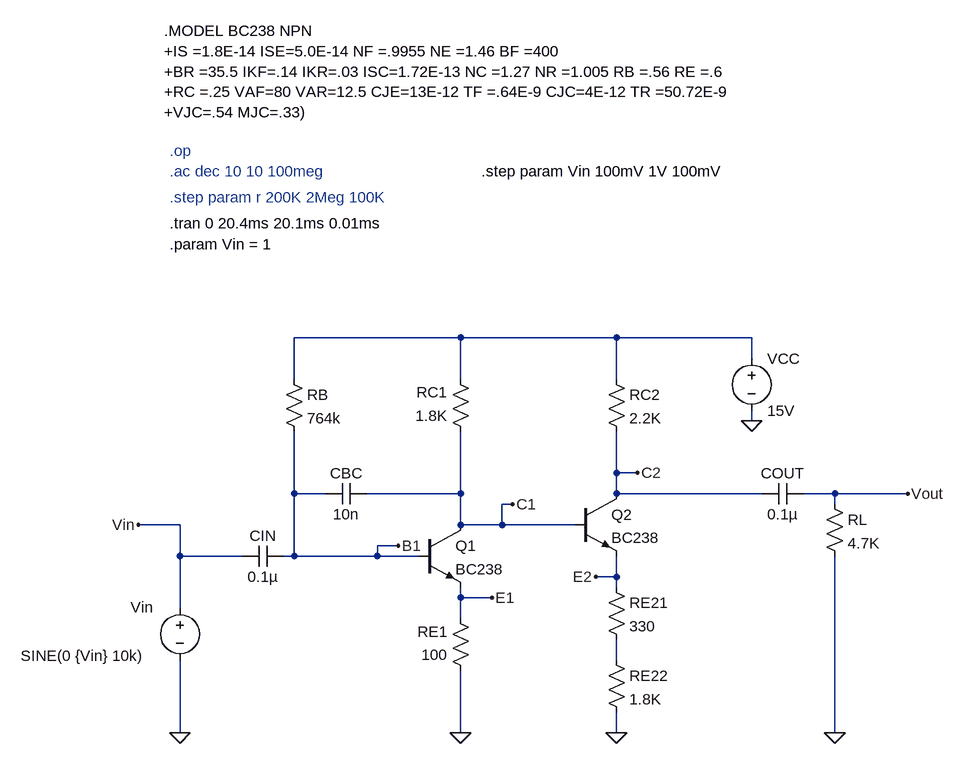
[diagram p0: schematic exercise3_1v2.asc]
exercise3_1v2.asc, the LTspice schematic file:
Version 4.1
SHEET 1 1064 680
WIRE 304 -272 48 -272
WIRE 544 -272 304 -272
WIRE 752 -272 544 -272
WIRE 752 -240 752 -272
WIRE 48 -208 48 -272
WIRE 304 -208 304 -272
WIRE 544 -208 544 -272
WIRE 752 -144 752 -160
WIRE 544 -64 544 -128
WIRE 576 -64 544 -64
WIRE 48 -32 48 -128
WIRE 96 -32 48 -32
WIRE 304 -32 304 -128
WIRE 304 -32 160 -32
WIRE 544 -32 544 -64
WIRE 768 -32 544 -32
WIRE 880 -32 832 -32
WIRE 992 -32 880 -32
WIRE 384 -16 368 -16
WIRE 880 -16 880 -32
WIRE -128 16 -192 16
WIRE 304 16 304 -32
WIRE 368 16 368 -16
WIRE 368 16 304 16
WIRE 480 16 368 16
WIRE 208 48 176 48
WIRE -128 64 -128 16
WIRE -32 64 -128 64
WIRE 48 64 48 -32
WIRE 48 64 32 64
WIRE 176 64 176 48
WIRE 176 64 48 64
WIRE 240 64 176 64
WIRE 544 96 544 64
WIRE 544 96 512 96
WIRE 544 112 544 96
WIRE 304 128 304 112
WIRE 352 128 304 128
WIRE -128 144 -128 64
WIRE 304 160 304 128
WIRE 544 224 544 192
WIRE -128 336 -128 224
WIRE 304 336 304 240
WIRE 544 336 544 304
WIRE 880 336 880 64
FLAG 992 -32 Vout
FLAG 752 -144 0
FLAG -192 16 Vin
FLAG 544 336 0
FLAG 304 336 0
FLAG 208 48 B1
FLAG 384 -16 C1
FLAG 576 -64 C2
FLAG 512 96 E2
FLAG 352 128 E1
FLAG 880 336 0
FLAG -128 336 0
SYMBOL res 320 -112 R180
WINDOW 0 36 76 Left 2
WINDOW 3 36 40 Left 2
SYMATTR InstName RC1
SYMATTR Value 1.8K
SYMBOL res 320 256 R180
WINDOW 0 36 76 Left 2
WINDOW 3 36 40 Left 2
SYMATTR InstName RE1
SYMATTR Value 100
SYMBOL res 528 -224 R0
SYMATTR InstName RC2
SYMATTR Value 2.2K
SYMBOL res 528 96 R0
SYMATTR InstName RE21
SYMATTR Value 330
SYMBOL res 864 -32 R0
SYMATTR InstName RL
SYMATTR Value 4.7K
SYMBOL voltage -128 128 R0
WINDOW 0 -76 15 Left 2
WINDOW 3 -245 89 Left 2
WINDOW 123 0 0 Left 0
WINDOW 39 0 0 Left 0
SYMATTR InstName Vin
SYMATTR Value SINE(0 {Vin} 10k)
SYMBOL cap 32 48 R90
WINDOW 0 0 32 VBottom 2
WINDOW 3 32 32 VTop 2
SYMATTR InstName CIN
SYMATTR Value 0.1µ
SYMBOL cap 832 -48 R90
WINDOW 0 0 32 VBottom 2
WINDOW 3 32 32 VTop 2
SYMATTR InstName COUT
SYMATTR Value 0.1µ
SYMBOL npn 240 16 R0
SYMATTR InstName Q1
SYMATTR Value BC238
SYMBOL npn 480 -32 R0
SYMATTR InstName Q2
SYMATTR Value BC238
SYMBOL voltage 752 -256 R0
SYMATTR InstName VCC
SYMATTR Value 15V
SYMBOL res 528 208 R0
SYMATTR InstName RE22
SYMATTR Value 1.8K
SYMBOL cap 160 -48 R90
WINDOW 0 0 32 VBottom 2
WINDOW 3 32 32 VTop 2
SYMATTR InstName CBC
SYMATTR Value 10n
SYMBOL res 32 -224 R0
SYMATTR InstName RB
SYMATTR Value 764k
TEXT -152 -744 Left 2 !.MODEL BC238 NPN\n+IS =1.8E-14 ISE=5.0E-14 NF =.9955 NE =1.46 BF =400\n+BR =35.5 IKF=.14 IKR=.03 ISC=1.72E-13 NC =1.27 NR =1.005 RB =.56 RE =.6\n+RC =.25 VAF=80 VAR=12.5 CJE=13E-12 TF =.64E-9 CJC=4E-12 TR =50.72E-9\n+VJC=.54 MJC=.33)
TEXT -144 -560 Left 2 ;.op
TEXT -144 -528 Left 2 ;.ac dec 10 10 100meg
TEXT -144 -488 Left 2 ;.step param r 200K 2Meg 100K
TEXT -144 -448 Left 2 !.tran 0 20.4ms 20.1ms 0.01ms
TEXT -144 -416 Left 2 !.param Vin = 1
TEXT 336 -528 Left 2 !.step param Vin 100mV 1V 100mV

The netlist it stands for:
* exercise3_1v2.asc
RC1 C1 N001 1.8K
RE1 0 E1 100
RC2 N001 C2 2.2K
RE21 E2 N002 330
RL Vout 0 4.7K
Vin Vin 0 SINE(0 {Vin} 10k)
CIN B1 Vin 0.1µ
COUT Vout C2 0.1µ
Q1 C1 B1 E1 0 BC238
Q2 C2 C1 E2 0 BC238
VCC N001 0 15V
RE22 N002 0 1.8K
CBC C1 B1 10n
RB N001 B1 764k
.model NPN NPN
.model PNP PNP
.lib standard.bjt
.MODEL BC238 NPN
+IS =1.8E-14 ISE=5.0E-14 NF =.9955 NE =1.46 BF =400
+BR =35.5 IKF=.14 IKR=.03 ISC=1.72E-13 NC =1.27 NR =1.005 RB =.56 RE =.6
+RC =.25 VAF=80 VAR=12.5 CJE=13E-12 TF =.64E-9 CJC=4E-12 TR =50.72E-9
+VJC=.54 MJC=.33)
* .op
* .ac dec 10 10 100meg
* .step param r 200K 2Meg 100K
.tran 0 20.4ms 20.1ms 0.01ms
.param Vin = 1
.step param Vin 100mV 1V 100mV
.backanno
.end